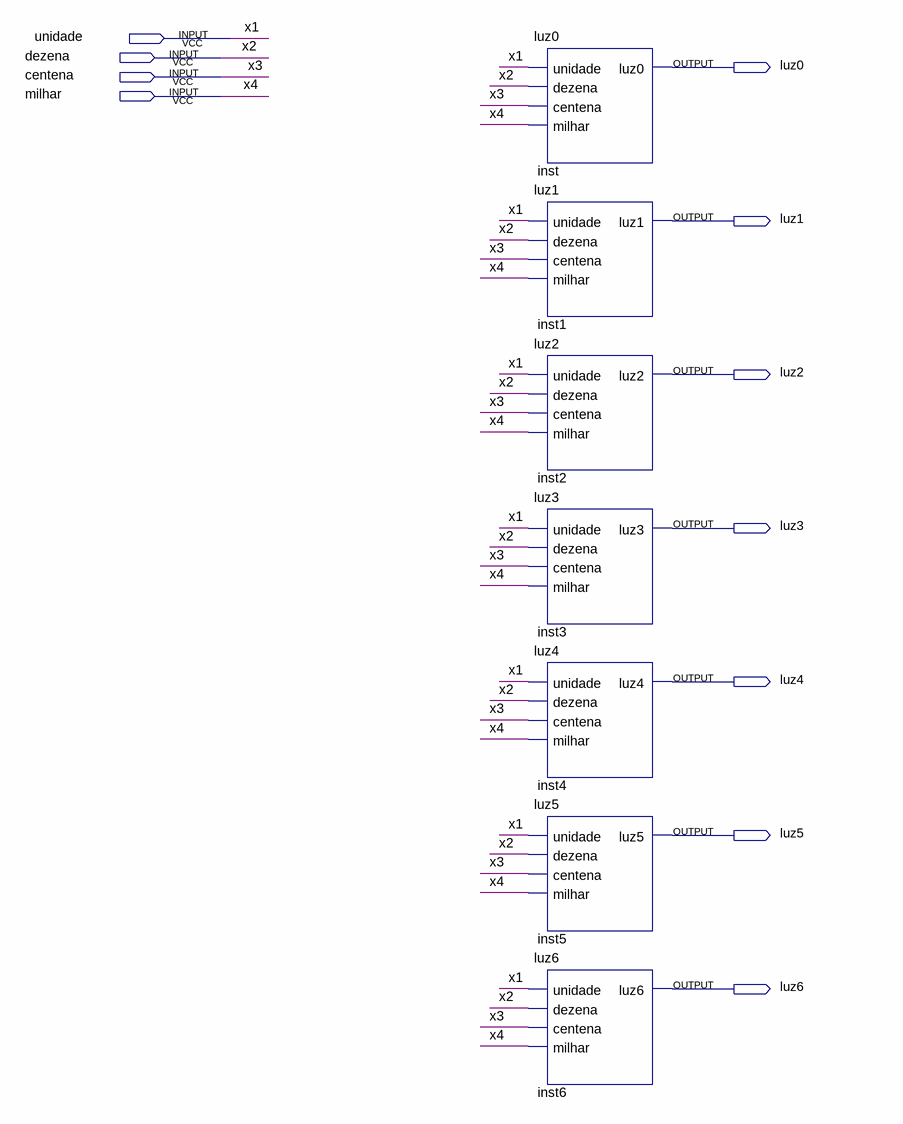
[diagram p0: schematic sheet]
// Quartus schematic Display.bdf as structural Verilog: 7 symbols, 11 pins
module Display (
  input  unidade,
  input  dezena,
  input  centena,
  input  milhar,
  output luz0,
  output luz1,
  output luz2,
  output luz3,
  output luz4,
  output luz5,
  output luz6
);

  luz0 inst (.unidade(unidade), .dezena(dezena), .centena(centena), .milhar(milhar), .luz0(luz0));
  luz1 inst1 (.unidade(unidade), .dezena(dezena), .centena(centena), .milhar(milhar), .luz1(luz1));
  luz2 inst2 (.unidade(unidade), .dezena(dezena), .centena(centena), .milhar(milhar), .luz2(luz2));
  luz3 inst3 (.unidade(unidade), .dezena(dezena), .centena(centena), .milhar(milhar), .luz3(luz3));
  luz4 inst4 (.unidade(unidade), .dezena(dezena), .centena(centena), .milhar(milhar), .luz4(luz4));
  luz5 inst5 (.unidade(unidade), .dezena(dezena), .centena(centena), .milhar(milhar), .luz5(luz5));
  luz6 inst6 (.unidade(unidade), .dezena(dezena), .centena(centena), .milhar(milhar), .luz6(luz6));

  // Other names for the same wires on the sheet: x1 = unidade; x2 = dezena; x3 = centena; x4 = milhar
endmodule
